# Altium schematic sheet ampnshift.SchDoc: Amp n' shift
size A4; Organization: Altium Limited; Address1: L3, 12a Rodborough Rd; Address2: Frenchs Forest; Address3: NSW; Address4: Australia 2086
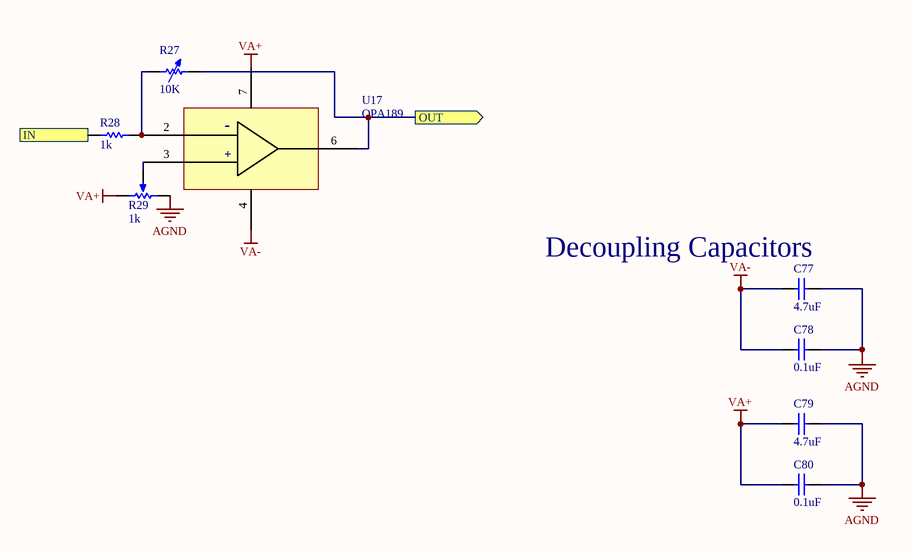
[diagram p0: ampnshift.SchDoc]

## Parts
C77  4.7uF  [STD_0805_C]
C78  0.1uF  [STD_0805_C]
C79  4.7uF  [STD_0805_C]
C80  0.1uF  [STD_0805_C]
R27  10K  [TRIMRES]
R28  1k  [STD_0805_R]
R29  1k  [TRIMPOT]
U17  OPA189  [SOIC_8]

## Ports
IN (in), OUT (out)

## Nets
AGND: C77.2 C78.2 C79.2 C80.2 R29.1(TOP)
VA+: C79.1 C80.1 R29.2(BOT) U17.7
VA-: C77.1 C78.1 U17.4
IN: R28.1 ; port IN
OUT: R27.2 U17.6 ; port OUT
NetR27_1: R27.1 R28.2 U17.2
NetR29_3: R29.3(TAP) U17.3

## Notes on the sheet
- (near C77) Decoupling Capacitors
- Title
- Date:
- RE:
- Arturo di Girolamo
- Size:
- A3
- A
- (in symbol OPA189IDR) -; +

## Library data of the parts
C77 C79 = CL21A475KAQNNNE: Capacitor, 4.7uF, 0805; Value: .01uf; MFGPN: CL21A475KAQNNNE
C78 C80 = CL21B104KACNNNC: Capacitor, 0.1uF, 0805; Value: .01uf; MFGPN: CL21B104KACNNNC
R27 = 3296W-1-103LF: Variable Resistor; MFGPN: 3296W-1-103LF
R28 = RNCP0805FTD1K00: 1K 1% 1/4W; Value: 1K; MFGPN: RNCP0805FTD1K00
R29 = PV36W102C01B00: Potentiometer, 1k; MFGPN: PV36W102C01B00
U17 = OPA189IDR: Precision OpAmp, Generic; MFGPN: OPA189IDR